# EAGLE design ETL_083012_59mm (EAGLE 6.1)
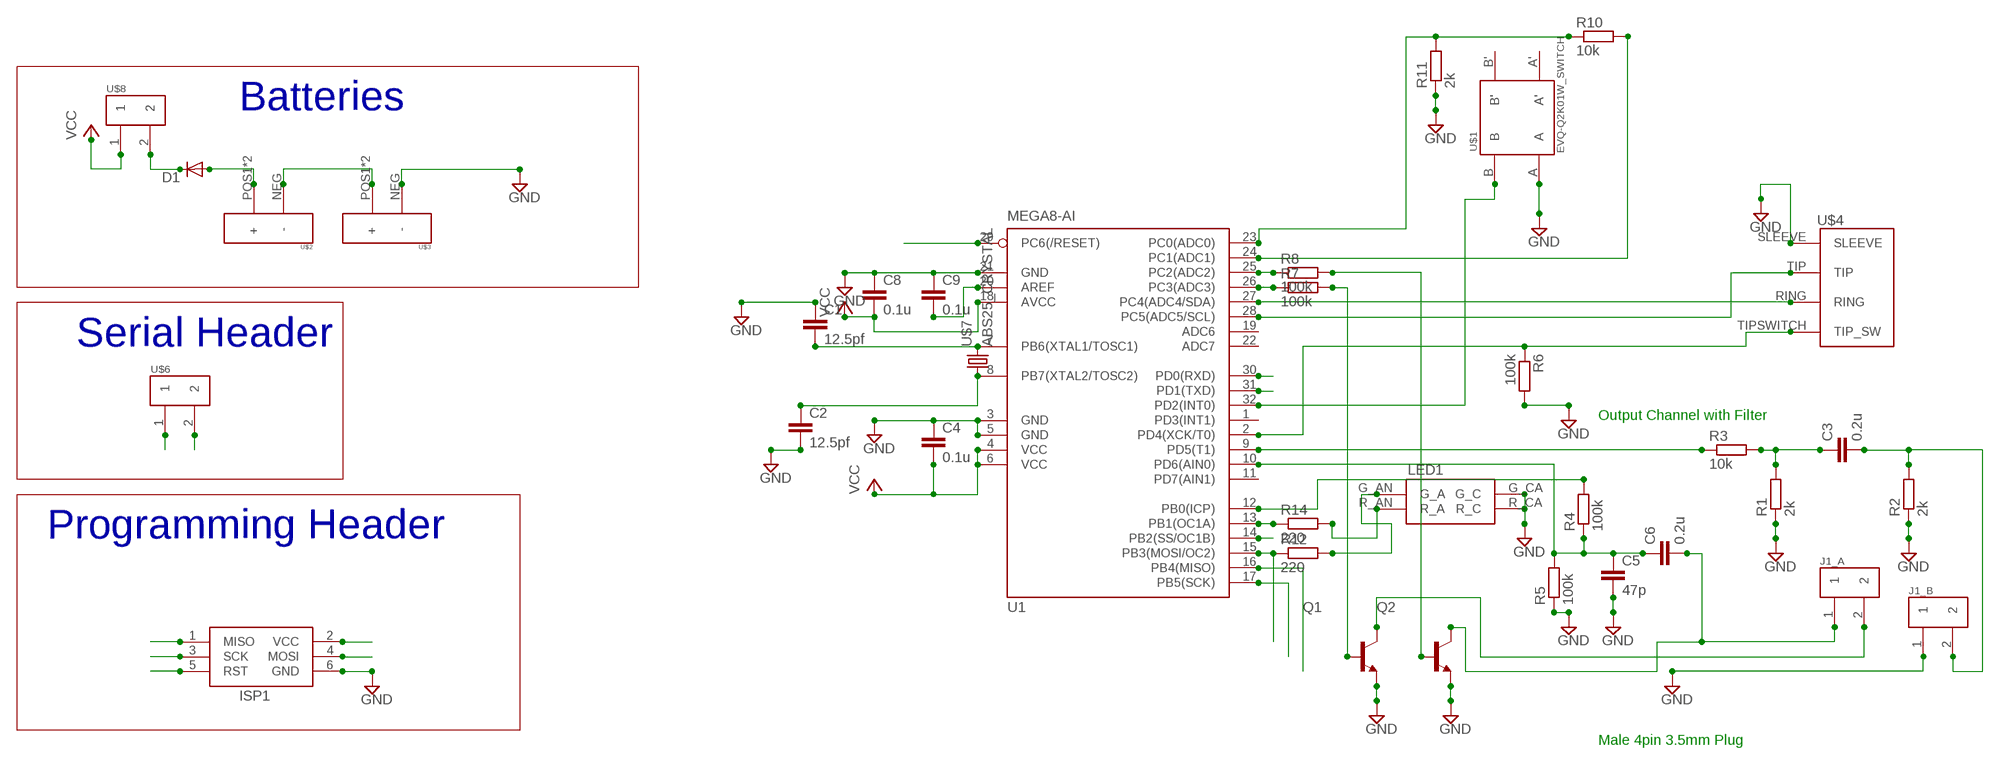
[diagram p0: schematic, sheet 1]

## Parts
C1  12.5pf  C-EUC0402  [C0402]
C2  12.5pf  C-EUC0402  [C0402]
C3  0.2u  C-EUC0402  [C0402]
C4  0.1u  C-EUC0402  [C0402]
C5  47p  C-EUC0402  [C0402]
C6  0.2u  C-EUC0402  [C0402]
C8  0.1u  C-EUC0402  [C0402]
C9  0.1u  C-EUC0402  [C0402]
D1  DIODE-SOD323-R  [SOD323-R]
ISP1  AVRISP-6  [AVRISP]
J1_A  SERIAL_2_VERT  [SERIAL_2_VERT]
J1_B  SERIAL_2_VERT  [SERIAL_2_VERT]
LED1  LED_BI_RG  [LED_BI_1210]
Q1  BC847-NPN-SOT23-BEC  [SOT23-BEC]
Q2  BC847-NPN-SOT23-BEC  [SOT23-BEC]
R1  2k  R-EU_R0402  [R0402]
R2  2k  R-EU_R0402  [R0402]
R3  10k  R-EU_R0402  [R0402]
R4  100k  R-EU_R0402  [R0402]
R5  100k  R-EU_R0402  [R0402]
R6  100k  R-EU_R0402  [R0402]
R7  100k  R-EU_R0402  [R0402]
R8  100k  R-EU_R0402  [R0402]
R10  10k  R-EU_R0402  [R0402]
R11  2k  R-EU_R0402  [R0402]
R12  220  R-EU_R0402  [R0402]
R14  220  R-EU_R0402  [R0402]
U1  MEGA8-AI  [TQFP32-08]
U$1  EVQ-Q2K01W_SWITCH  [EVQ-Q2K01W_SWITCH]
U$2  22M2620_BATTHOLDER  [22M2620_BATTHOLDER]
U$3  22M2620_BATTHOLDER  [22M2620_BATTHOLDER]
U$4  SJ-3524-SMT_AUDIOJACK  [SJ-3524-SMT_AUDIOJACK]
U$6  SERIAL_2_VERT  [SERIAL_2_VERT]
U$7  ABS25_CRYSTAL  [ABS25_CRYSTAL]
U$8  SERIAL_2_VERT  [SERIAL_2_VERT]

## Nets
GND: C1.1 C2.2 C4.1 C5.2 C8.1 C9.1 ISP1.6(GND) J1_B.1 LED1.G_CA(G_C) LED1.R_CA(R_C) Q1.E Q2.E R1.1 R2.1 R5.1 R6.2 R11.1 U1.3(GND) U1.5(GND) U1.21(GND) U$1.A U$3.NEG(-) U$4.SLEEVE
MISO: ISP1.1(MISO) U1.16(PB4(MISO))
MOSI: ISP1.4(MOSI) R12.1 U1.15(PB3(MOSI/OC2))
N$1: C1.2 U1.7(PB6(XTAL1/TOSC1)) U$7.4
N$2: C2.1 U1.8(PB7(XTAL2/TOSC2)) U$7.1
N$3: U1.14(PB2(SS/OC1B))
N$4: R14.1 U1.13(PB1(OC1A))
N$6: LED1.G_AN(G_A) R12.2
N$7: D1.C U$8.2
N$8: LED1.R_AN(R_A) R14.2
N$9: R3.1 U1.9(PD5(T1))
N$10: C5.1 C6.1 R4.1 R5.2 U1.10(PD6(AIN0))
N$11: C3.1 R1.2 R3.2
N$12: C3.2 J1_B.2 R2.2
N$14: R8.1 U1.25(PC2(ADC2))
N$16: R10.2 U1.24(PC1(ADC1))
N$17: R7.1 U1.26(PC3(ADC3))
N$18: U$2.NEG(-) U$3.POS1(+) U$3.POS2(+)
N$21: C9.2 U1.20(AREF)
N$22: R10.1 R11.2 U1.23(PC0(ADC0))
N$24: Q1.B R7.2
N$25: Q2.B R8.2
N$26: U1.32(PD2(INT0)) U$1.B
N$27: D1.A U$2.POS1(+) U$2.POS2(+)
N$28: J1_A.2 Q1.C
N$29: C6.2 J1_A.1 Q2.C
N$35: R4.2 U1.12(PB0(ICP))
PC4: U1.27(PC4(ADC4/SDA)) U$4.RING
PC5: U1.28(PC5(ADC5/SCL)) U$4.TIP
PD0: U1.30(PD0(RXD)) U$6.1
PD1: U1.31(PD1(TXD)) U$6.2
PD4: R6.1 U1.2(PD4(XCK/T0)) U$4.TIPSWITCH(TIP_SW)
RESET: ISP1.5(RST) U1.29(PC6(/RESET))
SCK: ISP1.3(SCK) U1.17(PB5(SCK))
VCC: C4.2 C8.2 ISP1.2(VCC) U1.4(VCC) U1.6(VCC) U1.18(AVCC) U$8.1
Unconnected: U1.1(PD3(INT1)) U1.11(PD7(AIN1)) U1.19(ADC6) U1.22(ADC7) U$1.A' U$1.B'

## Notes on the sheet
- Batteries
- Serial Header
- Output Channel with Filter
- Programming Header
- Male 4pin 3.5mm Plug

## Library data of the parts
C1-C6 C8 C9 = resistor:C-EU: CAPACITOR, European symbol
D1 = diode:DIODE-: DIODE
ISP1 = adafruit:AVRISP: AVR ISP HEADER Standard 6 pin header for AVR programming
J1_A J1_B U$6 U$8 = MilesGuidon:SERIAL_2_VERT
LED1 = MilesGuidon:LED_BI_RG
Q1 Q2 = transistor:*-NPN-: NPN Transistror BF959 corrected 2008.03.06
R1-R8 R10-R12 R14 = resistor:R-EU_: RESISTOR, European symbol
U1 = atmel:MEGA8: MICROCONTROLLER 8 Kbytes FLASH, 1 kbytes SRAM, 512 bytes EEPROM, USART, 6-channel 10 bit ADC, 2-channel 8 bit ADC Pin compatible with Atmega48, ATMega88, ATMega168 Source: avr.lbr; MPN: ATMEGA8-16AU; OC_FARNELL: 9171371; OC_NEWARK: 73M8863
U$1 = MilesGuidon:EVQ-Q2K01W_SWITCH
U$2 U$3 = MilesGuidon:22M2620_BATTHOLDER
U$4 = MilesGuidon:SJ-3524-SMT_AUDIOJACK
U$7 = MilesGuidon:ABS25_CRYSTAL

## Board
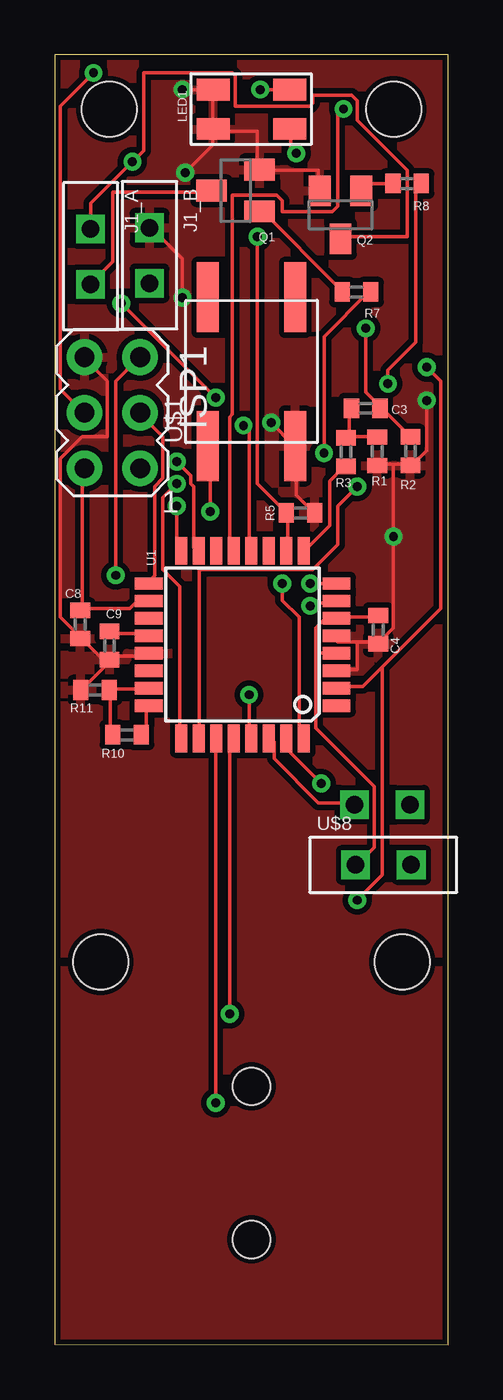
[diagram p1: board, top side]
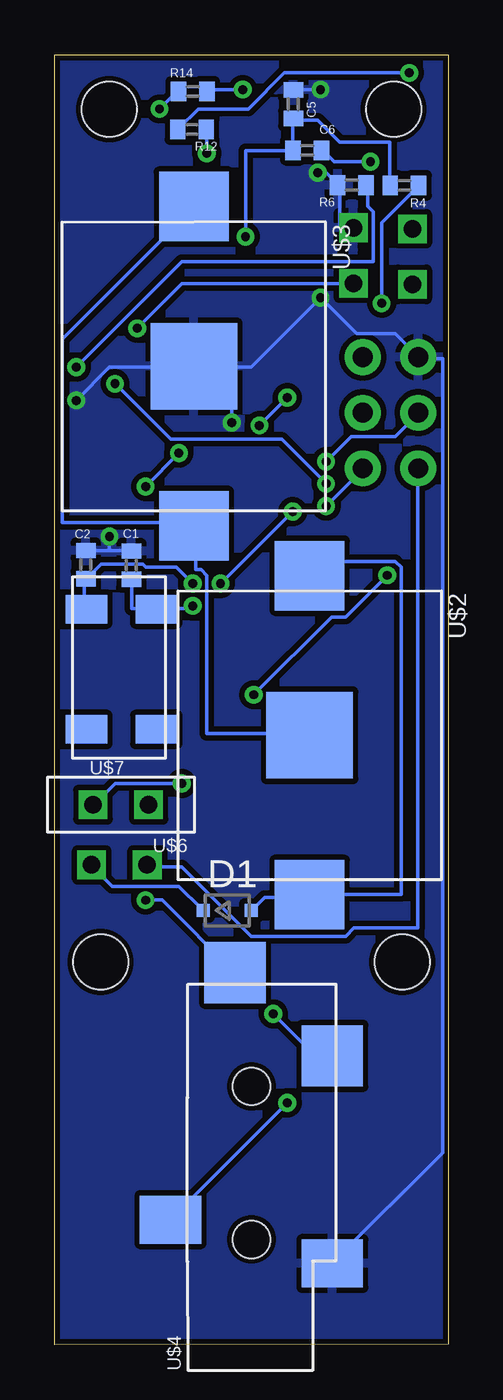
[diagram p2: board, bottom side, seen from below]

Size 18 x 59.03 mm. Coordinates in mm from the lower left corner, seen from the top.
Outline: 0,0.03 18,0 18,59.03 0,59.03 0,0.03
Copper layers (1*16): Top 0.035mm / dielectric 1.5mm / Bottom 0.035mm
Design rules: minimum track width 6mil, minimum drill 16mil, track to track 6mil, track to pad 6mil, pad to pad 6mil, via to via 6mil, smd to smd 6mil, copper to edge 6mil, drill to drill 6mil, minimum pad ring 10mil, minimum via ring 8mil, stop-mask expansion 4mil, vias tented up to drill 0mil, thermal gap 10mil
Holes 2.5 mm at 2.5,56.53 2.1,17.53 15.5,56.53 15.9,17.53

### Footprints (pad centres in the part's own frame; a part is rotated, then mirrored left to right if it is on the bottom)
C0402 = smd 0.7 x 0.9: 1 -0.65,0; 2 0.65,0
SOD323-R = smd 0.6 x 0.6: A 1.1,0; C -1.1,0
AVRISP = drill 0.9 pad 1.626: 1 -1.27,2.54; 2 1.27,2.54; 3 -1.27,0; 4 1.27,0; 5 -1.27,-2.54; 6 1.27,-2.54
SERIAL_2_VERT = drill 0.8 square: 1 -1.27,0; 2 1.27,0
LED_BI_1210 = smd 1.5 x 1: G_AN -1.75,0.9; G_CA 1.75,0.9; R_AN -1.75,-0.9; R_CA 1.75,-0.9
SOT23-BEC = smd 1 x 1.4: B -0.95,-1.1; C 0,1.1; E 0.95,-1.1
R0402 = smd 0.7 x 0.9: 1 -0.65,0; 2 0.65,0
TQFP32-08 = smd 1.27 x 0.559: 1 -4.293,2.8; 2 -4.293,2; 3 -4.293,1.2; 4 -4.293,0.4; 5 -4.293,-0.4; 6 -4.293,-1.2; 7 -4.293,-2; 8 -4.293,-2.8; 17 4.293,-2.8; 18 4.293,-2; 19 4.293,-1.2; 20 4.293,-0.4; 21 4.293,0.4; 22 4.293,1.2; 23 4.293,2; 24 4.293,2.8 | smd 0.559 x 1.27: 9 -2.8,-4.293; 10 -2,-4.293; 11 -1.2,-4.293; 12 -0.4,-4.293; 13 0.4,-4.293; 14 1.2,-4.293; 15 2,-4.293; 16 2.8,-4.293; 25 2.8,4.293; 26 2,4.293; 27 1.2,4.293; 28 0.4,4.293; 29 -0.4,4.293; 30 -1.2,4.293; 31 -2,4.293; 32 -2.8,4.293
EVQ-Q2K01W_SWITCH = smd 3.2 x 1: A -3.4,-2; A' 3.4,-2; B -3.4,2; B' 3.4,2
22M2620_BATTHOLDER = smd 3.962 x 3.962: NEG 0,0 | smd 3.175 x 3.175: POS1 -7.303,0; POS2 7.303,0
SJ-3524-SMT_AUDIOJACK = smd 2.2 x 2.8: RING -2.6,3.7; SLEEVE -4.6,-3.7 | smd 2.8 x 2.8: TIP 4.9,-3.7; TIPSWITCH 8.7,0.75 | hole 1.7: -3.5,0; 3.5,0
ABS25_CRYSTAL = smd 1.3 x 1.9: 1 -2.75,-1.6; 2 2.75,-1.6; 3 2.75,1.6; 4 -2.75,1.6

### Placement (x,y rotation side)
C1  14.49,35.67 270 bottom
C2  16.57,35.69 90 bottom
C3  14.22,42.85 0 top
C4  14.8,32.72 90 top
C5  7.08,56.76 90 bottom
C6  6.45,54.65 0 bottom
C8  1.17,32.96 90 top
C9  2.51,32 90 top
D1  10.11,19.87 0 bottom
ISP1  2.64,42.65 180 top
J1_A  1.64,49.79 270 top
J1_B  4.34,49.84 270 top
LED1  9,56.53 180 top
Q1  8.27,52.8 90 top
Q2  13.07,51.69 180 top
R1  14.75,40.88 90 top
R2  16.27,40.88 90 top
R3  13.32,40.84 90 top
R4  2.01,53.04 0 bottom
R5  11.24,38.06 180 top
R6  4.41,53.05 180 bottom
R7  13.8,48.17 180 top
R8  16.12,53.13 180 top
R10  3.31,27.91 0 top
R11  1.84,29.96 0 top
R12  11.72,55.6 0 bottom
R14  11.69,57.34 0 bottom
U1  8.59,32.03 180 top
U$1  9,44.53 90 top
U$2  6.34,27.89 270 bottom
U$3  11.64,44.77 270 bottom
U$4  9,8.33 90 bottom
U$6  14.98,24.71 180 bottom
U$7  14.95,30.91 270 bottom
U$8  15.04,21.96 0 top

### Tracks (layer width: path | path; a pad name or v marks a point on that pad's centre or on a via)
GND  (via drill 0.41)
  Top 0.152: v5.84,57.43 LED1.R_CA 7.24,57.3 7.24,55.65 LED1.G_CA | Q2.E 12.06,52.86 12.06,53.75 9.4,53.75 Q1.E 9.27,53.87 9.27,55.52 7.37,55.52 LED1.G_CA | v5.97,53.62 7.24,54.89 7.24,55.52 LED1.G_CA | 15.49,40.28 16.26,40.28 R2.1 16.38,40.28 17.02,40.92 v17.02,43.21 | 15.49,40.28 14.86,40.28 R1.1 | 13.84,32.16 12.95,32.16 12.95,32.41 U1.5 | 13.84,32.16 14.73,32.16 C4.1 14.86,32.16 15.49,32.79 v15.49,36.98 15.49,40.28 | 13.84,32.16 13.84,30.89 12.95,30.89 U1.3 | R5.1 11.81,38.13 11.05,38.89 11.05,41.05 U$1.A 10.92,41.17 v9.91,42.19 | v5.84,47.9 5.84,49.68 4.45,51.08 J1_B.1 | 2.41,31.14 1.27,30 R11.1 | 2.41,31.14 2.41,31.27 C9.1 | 2.41,31.14 1.27,32.28 C8.1 1.14,32.41 0.25,33.3 0.25,40.54 1.27,41.55 2.41,41.55 2.41,44.09 1.4,45.11 ISP1.6 1.4,45.24 | 2.41,31.14 C9.1 | U1.21 4.19,31.52 2.54,31.52 2.54,31.39 C9.1
  Bottom 0.152: J1_B.1 4.45,51.21 4.95,51.21 4.95,52.98 R6.2 5.08,53.11 5.59,53.62 v5.97,53.62 | v5.84,57.43 6.99,57.43 C5.2 | 15.49,36.35 16.51,36.35 C2.2 | 15.49,36.35 14.61,36.35 C1.1 | v15.49,36.98 15.49,36.35 | 9.91,44.73 v9.91,42.19 | 9.91,44.73 11.56,44.73 U$3.NEG | v17.02,43.21 15.49,44.73 11.68,44.73 U$3.NEG | 9.91,44.73 9.02,44.73 v5.84,47.9 4.19,46.25 2.41,46.25 1.4,45.24 ISP1.6 1.27,45.11 0.25,45.11 0.25,8.79 5.21,3.84 U$4.SLEEVE | 9.91,44.73 U$3.NEG
  pour Bottom (isolate 0.254): 0,59 18.08,59 18.08,0.13 0,0.13
  pour Top (isolate 0.254): 0,58.95 18.08,58.95 18.08,0.13 0,0.13
MISO  (via drill 0.41)
  Top 0.152: v5.59,38.38 5.59,36.47 5.71,36.35 U1.16
  Bottom 0.152: v5.59,38.38 3.94,40.03 ISP1.1
MOSI  (via drill 0.41)
  Top 0.152: v1.78,58.19 0.25,56.67 0.25,43.71 1.27,42.7 ISP1.4 | v5.59,40.41 6.22,39.78 6.22,39.4 6.35,39.27 6.35,36.47 6.48,36.35 U1.15
  Bottom 0.152: v1.78,58.19 7.49,58.19 9.14,56.54 11.43,56.54 12.32,55.65 R12.1 | v5.59,40.41 4.45,41.55 2.41,41.55 1.4,42.57 ISP1.4
N$1  (via drill 0.41)
  Top 0.152: v11.68,33.81 11.68,33.93 12.83,33.93 U1.7
  Bottom 0.152: C1.2 14.48,34.95 14.48,33.68 13.46,33.68 U$7.4 13.34,33.68 11.81,33.68 v11.68,33.81
N$2  (via drill 0.41)
  Top 0.152: v11.68,34.82 12.83,34.82 U1.8
  Bottom 0.152: U$7.1 16.64,33.68 16.64,34.95 C2.1 16.51,35.08 15.88,35.71 13.97,35.71 13.84,35.59 12.45,35.59 v11.68,34.82
N$4  (via drill 0.41)
  Top 0.152: v13.21,56.54 12.95,56.29 12.95,52.1 12.7,51.84 10.41,51.84 10.41,52.35 10.16,52.6 8.13,52.6 8.13,42.57 8,42.44 8,36.47 8.13,36.35 U1.13
  Bottom 0.152: v13.21,56.54 12.45,57.3 R14.1
N$6  (via drill 0.41)
  Top 0.152: v11.05,54.51 10.79,54.76 10.79,55.52 LED1.G_AN
  Bottom 0.152: v11.05,54.51 11.05,55.52 R12.2
N$7
  Bottom 0.152: D1.C 11.3,19.96 12.32,20.98 15.37,20.98 16.26,21.87 U$8.2
N$8  (via drill 0.41)
  Top 0.152: v9.4,57.43 10.67,57.43 LED1.R_AN
  Bottom 0.152: v9.4,57.43 10.92,57.43 R14.2
N$9
  Top 0.152: R3.1 13.21,40.16 12.57,39.52 12.57,37.49 11.43,36.35 U1.9
N$10  (via drill 0.41)
  Top 0.152: U1.10 10.67,36.35 10.67,38 R5.2 10.54,38.13 9.27,39.4 v9.27,50.7
  Bottom 0.152: R4.1 2.67,53.11 2.67,55.02 4.95,55.02 5.97,56.03 6.99,56.03 C5.1 7.11,56.03 7.11,54.76 C6.1 7.11,54.64 9.27,54.64 v9.27,50.7
N$11
  Top 0.152: 13.34,41.55 13.46,41.68 13.46,42.82 C3.1 | 13.34,41.55 14.73,41.55 R1.2 | 13.34,41.55 R3.2
N$12  (via drill 0.41)
  Top 0.152: R2.2 16.26,41.55 14.99,42.82 C3.2 14.86,42.95 14.22,43.59 v14.22,46.51
  Bottom 0.152: v14.22,46.51 12.19,48.54 4.45,48.54 J1_B.2
N$14  (via drill 0.41)
  Top 0.152: v15.24,43.97 15.24,44.6 16.51,45.87 16.51,52.86 16.76,53.11 R8.1 | v5.59,39.4 4.95,38.76 4.95,35.46 5.71,34.7 5.71,27.84 U1.25
  Bottom 0.152: v15.24,43.97 12.7,41.43 7.62,41.43 v5.59,39.4
N$16
  Top 0.152: R10.2 4.06,27.97 4.19,28.09 4.19,29.11 U1.24
N$17  (via drill 0.41)
  Top 0.152: v12.32,40.79 12.32,46.13 14.35,48.16 R7.1 | v13.84,39.27 12.95,38.38 12.95,36.6 11.81,35.46 6.6,35.46 6.6,27.84 U1.26
  Bottom 0.152: v13.84,39.27 v12.32,40.79
N$18
  Bottom 0.152: U$2.NEG 6.35,27.97 11.05,27.97 11.05,35.2 11.3,35.46 11.56,35.46 11.56,37.36 U$3.POS2 11.68,37.49 11.81,37.62 17.65,37.62 17.65,46 11.68,51.97 U$3.POS1
N$21
  Top 0.152: C9.2 2.54,32.54 4.19,32.54 U1.20
N$22
  Top 0.152: U1.23 4.19,30 2.54,30 R11.2 2.54,29.87 2.54,27.97 R10.1
N$24
  Top 0.152: R7.2 13.08,48.29 9.4,51.97 Q1.B
N$25
  Top 0.152: R8.2 15.37,53.11 14.1,53.11 14.1,52.86 Q2.B
N$26  (via drill 0.41)
  Top 0.152: v10.41,34.82 10.41,34.06 11.18,33.3 11.18,27.97 11.3,27.84 U1.32 | v7.11,38.13 7.11,41.05 U$1.B
  Bottom 0.152: v7.11,38.13 v10.41,34.82
N$27
  Bottom 0.152: D1.A 8.89,19.96 8.38,20.47 6.35,20.47 U$2.POS2 6.22,20.6 2.16,20.6 2.16,35.59 2.41,35.84 5.59,35.84 6.22,35.2 U$2.POS1
N$28
  Top 0.152: Q1.C 7.11,52.73 2.67,52.73 2.67,49.56 1.65,48.54 J1_A.2
N$29  (via drill 0.41)
  Top 0.152: J1_A.1 1.65,51.08 1.65,52.22 v3.56,54.13 4.06,54.64 4.06,58.19 8.13,58.19 8.26,58.06 8.26,56.67 11.68,56.67 11.81,56.79 11.81,57.18 13.59,57.18 13.84,56.92 13.84,56.03 16.13,53.75 16.13,50.7 13.08,50.7 Q2.C
  Bottom 0.152: v3.56,54.13 5.21,54.13 5.71,54.64 C6.2
N$35  (via drill 0.41)
  Top 0.152: v7.37,43.33 v3.05,47.65 | v8.64,42.06 8.89,41.81 8.89,36.35 U1.12
  Bottom 0.152: v3.05,47.65 3.05,51.33 1.4,52.98 R4.2 | v8.64,42.06 v7.37,43.33
PC4  (via drill 0.41)
  Top 0.152: v7.37,11.07 7.37,27.71 U1.27
  Bottom 0.152: v7.37,11.07 12.7,5.74 U$4.RING
PC5  (via drill 0.41)
  Top 0.152: v8,15.14 8,27.58 8.13,27.71 U1.28
  Bottom 0.152: v8,15.14 6.1,13.23 5.33,13.23 U$4.TIP
PD0
  Top 0.152: U1.30 9.91,27.71 10.03,27.58 10.03,26.82 12.06,24.79 13.59,24.79 U$6.1
PD1  (via drill 0.41)
  Top 0.152: v12.19,25.68 10.79,27.08 10.79,27.58 10.67,27.71 U1.31
  Bottom 0.152: v12.19,25.68 15.24,25.68 16.13,24.79 U$6.2
PD4  (via drill 0.41)
  Top 0.152: v17.02,44.73 17.65,44.09 17.65,33.68 14.99,31.01 | 14.99,31.01 14.1,30.12 12.95,30.12 U1.2 | v13.84,20.35 14.99,21.49 14.99,31.01
  Bottom 0.152: v17.02,44.73 12.19,49.56 3.43,49.56 3.43,51.84 3.68,52.1 3.68,52.98 R6.1 | v13.84,20.35 13.08,20.35 9.78,17.04 U$4.TIPSWITCH
RESET  (via drill 0.41)
  Top 0.152: v8.89,29.74 8.89,27.84 U1.29 | v2.79,35.2 2.79,44.09 3.81,45.11 ISP1.5
  Bottom 0.152: v8.89,29.74 5.33,33.3 4.7,33.3 v2.79,35.2
SCK
  Top 0.152: U1.17 4.32,34.95 4.57,35.2 4.57,39.27 4.95,39.65 4.95,41.55 3.94,42.57 ISP1.3
VCC
  Top 0.152: 1.27,33.68 3.43,33.68 3.68,33.93 4.19,33.93 U1.18 | 1.27,33.68 1.27,40.03 ISP1.2 1.4,40.16 | 1.27,33.68 C8.2 | C4.2 14.73,33.3 12.95,33.3 U1.6 12.83,33.17 12.32,33.17 11.94,32.79 11.94,31.65 | 11.94,31.65 12.83,31.65 U1.4 | 11.94,31.65 11.94,28.22 14.61,25.55 14.61,22.76 13.84,22 U$8.1
  Bottom 0.152: ISP1.2 1.4,40.03 1.4,19.08 4.32,19.08 4.7,18.69 9.02,18.69 12.19,21.87 13.72,21.87 U$8.1

### Text on the board
Unrouted: COVERED VIAS | COVERED VIAS | COVERED VIAS | COVERED VIAS | male audio jack wiring ports | COVERED VIAS | COVERED VIAS | COVERED VIAS | COVERED VIAS | NOTES | Board Dimensions: X=18mm, Y=59mm | Must order board with "Tented Vias"